# Altium schematic sheet DC-DC TPS65135.schdoc
size A2
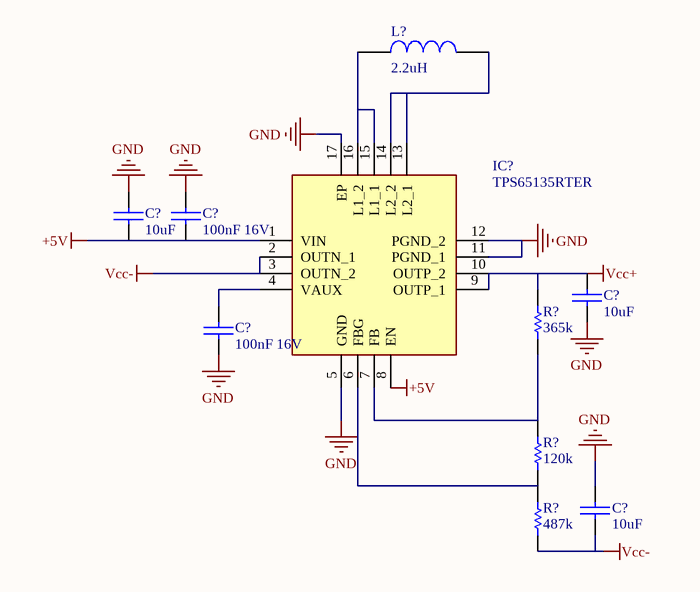
[diagram p0: DC-DC TPS65135.schdoc]

## Parts
(Parts that share a designator on the sheet are numbered #1, #2 ... from top to bottom, then left to right.)
C?#1  10uF  [0603C]
C?#2  100nF 16V  [0402C]
C?#3  10uF  [0603C]
C?#4  100nF 16V  [0402C]
C?#5  10uF  [0603C]
IC?  TPS65135RTER  [QFN50P300X300X80-17N-D]
L?  2.2uH  [1210L]
R?#1  365k  [0402R]
R?#2  120k  [0402R]
R?#3  487k  [0402R]

## Nets
+5V: C?#1.1 C?#2.1 IC?.1(VIN) IC?.8(EN)
GND: C?#1.2 C?#2.2 C?#3.1 C?#4.1 C?#5.2 IC?.5(GND) IC?.11(PGND_1) IC?.12(PGND_2) IC?.17(EP)
Vcc+: C?#3.2 IC?.9(OUTP_1) IC?.10(OUTP_2) R?#1.2
Vcc-: C?#5.1 IC?.2(OUTN_1) IC?.3(OUTN_2) R?#3.1
NetC?#4_2: C?#4.2 IC?.4(VAUX)
NetIC?_6: IC?.6(FBG) R?#2.1 R?#3.2
NetIC?_7: IC?.7(FB) R?#1.1 R?#2.2
NetIC?_13: IC?.13(L2_1) IC?.14(L2_2) L?.2
NetIC?_15: IC?.15(L1_1) IC?.16(L1_2) L?.1

## Library data of the parts
C?#1 C?#3 C?#5 = CAP-NP
C?#2 C?#4 = CAP-NP: Manufacturer 1: Samsung; Manufacturer Part Number 1: CL05B104KO5NNNC; Description 1: CAP CER 0.1UF 16V X7R 0402; Material: Ceramic; Tolerance: 10%; Dielectric: X7R; Supplier 1: LCSC; Supplier Part Number 1: C1525; Stock 1: 5012200; Pricing 1: 100=0.0023, 1000=0.002, 3000=0.0018, 10000=0.0017, 50000=0.0017, 100000=0.0017, 100=0.0021, 1000=0.0018, 3000=0.0017, 10000=0.0016, 50000=0.0016, 100000=0.0016, 100=0.0107, 1000=0.0094, 3000=0.0087, 10000=0.008, 50000=0.008, 100000=0.008, 100=0.0102, 1000=0.0089, 3000=0.0083, 10000=0.0077, 50000=0.0077, 100000=0.0077, 100=0.0014, 1000=0.0012, 3000=0.0011, 10000=0.001, 50000=0.001, 100000=0.001, 100=0.0012, 1000=0.0011, 3000=0.001, 10000=0.0009, 50000=0.0009, 100000=0.0009, 100=0.0124, 1000=0.0109, 3000=0.0101, 10000=0.0093, 50000=0.0093, 100000=0.0093, 100=0.1676, 1000=0.1466, 3000=0.1361, 10000=0.1257, 50000=0.1257, 100000=0.1257, 100=0.0066, 1000=0.0058, 3000=0.0054, 10000=0.005, 50000=0.005, 100000=0.005, 100=0.1289, 1000=0.1128, 3000=0.1048, 10000=0.0967, 50000=0.0967, 100000=0.0967, 100=0.0142, 1000=0.0125, 3000=0.0116, 10000=0.0107, 50000=0.0107, 100000=0.0107, 100=0.0022, 1000=0.0019, 3000=0.0018, 10000=0.0016, 50000=0.0016, 100000=0.0016, 100=0.0016, 1000=0.0014, 3000=0.0013, 10000=0.0012, 50000=0.0012, 100000=0.0012 (AUD); Mount: Surface Mount; Case/Package: 0402; Case Code (Metric): 1005; Case Code (Imperial): 0402; Contact Plating: Tin; Min Operating Temperature: -55°C; Max Operating Temperature: 125°C; Capacitance: 100nF; Packaging: Tape and Reel; Voltage Rating: 16V; Voltage Rating (DC): 16V; Package Quantity: 1; Voltage: 16V; Length: 1mm; Width: 0.02inch; Height 1: 0.5mm; Thickness: 0.022inch; Depth: 0.5mm; Radiation Hardening: No; Lead Free: Lead Free; ComponentLink1URL: http://www1.futureelectronics.com/doc/SAMSUNG%20PASSIVE/CL05B104KQ5NNNC.pdf?src-supplier=Future+Electronics; ComponentLink1Description: http://www1.futureelectronics.com/doc/SAMSUNG%20PASSIVE/CL05B104KQ5NNNC.pdf?src-supplier=Future+Electronics; ComponentLink2URL: https://www.verical.com/server-webapp/html/getDatasheet?partID=359683&src-supplier=Verical; ComponentLink2Description: https://www.verical.com/server-webapp/html/getDatasheet?partID=359683&src-supplier=Verical; ComponentLink3URL: https://www.distrelec.biz/Web/Downloads/_e/ng/MLCC_CatalogDownload2013_ENG.pdf?mime=application%2Fpdf&src-supplier=Distrelec; ComponentLink3Description: https://www.distrelec.biz/Web/Downloads/_e/ng/MLCC_CatalogDownload2013_ENG.pdf?mime=application%2Fpdf&src-supplier=Distrelec; ComponentLink4URL: https://produktinfo.conrad.com/datenblaetter/450000-474999/458718-da-01-en-VS_KONDENSATOR_0402.pdf?src-supplier=Conrad; ComponentLink4Description: https://produktinfo.conrad.com/datenblaetter/450000-474999/458718-da-01-en-VS_KONDENSATOR_0402.pdf?src-supplier=Conrad
IC? = TPS65135RTER: Integrated Circuit; Manufacturer_Name: Texas Instruments; Datasheet Link: http://www.ti.com/lit/gpn/tps65135; Height: 0.8mm; Manufacturer_Part_Number: TPS65135RTER; Arrow Part Number: TPS65135RTER; Arrow Price/Stock: https://www.arrow.com/en/products/tps65135rter/texas-instruments; Mouser Part Number: 595-TPS65135RTER; Mouser Price/Stock: https://www.mouser.co.uk/ProductDetail/Texas-Instruments/TPS65135RTER?qs=bS0R8qMSxJPTFpD2v51qPQ%3D%3D
L? = INDUCTOR
R?#1-R?#3 = RES